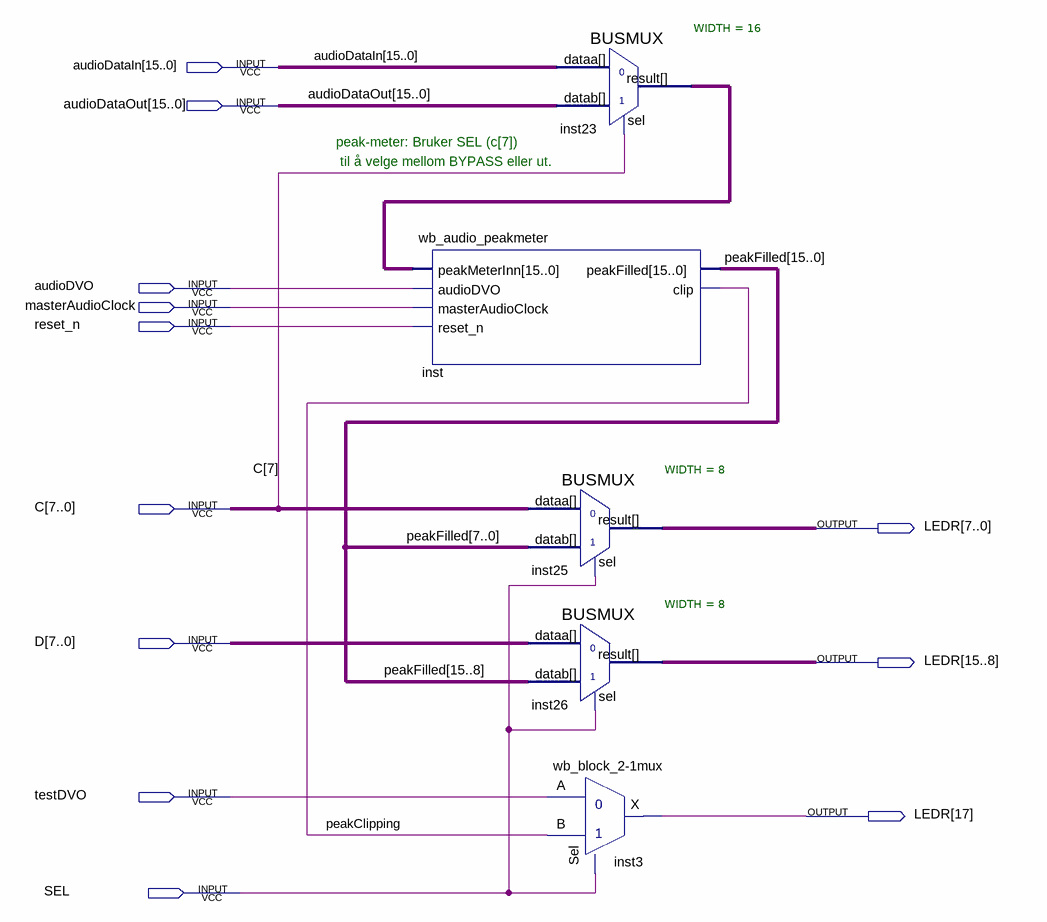
[diagram p0: schematic sheet]
// Quartus schematic wb_audioPeak_sw_LEDRmux.bdf as structural Verilog: 5 symbols, 12 pins
module wb_audioPeak_sw_LEDRmux (
  input  [15:0] audioDataIn,
  input  [15:0] audioDataOut,
  input  audioDVO,
  input  masterAudioClock,
  input  reset_n,
  input  [7:0] C,
  input  [7:0] D,
  input  testDVO,
  input  SEL,
  output [17:0] LEDR
);

  wire peakClipping;
  wire [15:0] inst23_result, peakFilled;

  wb_audio_peakmeter inst (
    .peakMeterInn(inst23_result), .audioDVO(audioDVO), .masterAudioClock(masterAudioClock),
    .reset_n(reset_n), .peakFilled(peakFilled), .clip(peakClipping));
  BUSMUX #(.WIDTH(16)) inst23 (.datab(audioDataOut), .sel(C[7]), .dataa(audioDataIn), .result(inst23_result));
  BUSMUX #(.WIDTH(8)) inst25 (.datab(peakFilled[7:0]), .sel(SEL), .dataa(C), .result(LEDR[7:0]));
  BUSMUX #(.WIDTH(8)) inst26 (.datab(peakFilled[15:8]), .sel(SEL), .dataa(D), .result(LEDR[15:8]));
  \wb_block_2-1mux  inst3 (.A(testDVO), .Sel(SEL), .B(peakClipping), .X(LEDR[17]));

  // Notes on the sheet:
  //   peak-meter: Bruker SEL (c[7])
  //    til å velge mellom BYPASS eller ut.
endmodule
